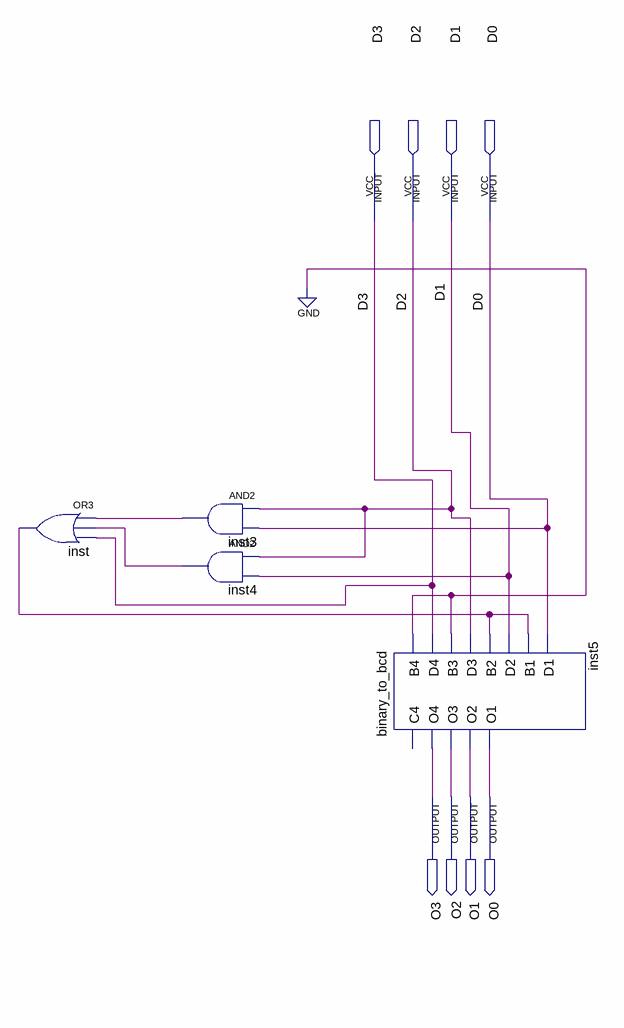
[diagram p0: schematic sheet]
// Quartus schematic Block2.bdf as structural Verilog: 4 symbols, 8 pins
module Block2 (
  input  D3,
  input  D2,
  input  D1,
  input  D0,
  output O3,
  output O2,
  output O1,
  output O0
);

  wire inst3_out, inst4_out, inst_out;

  or inst (inst_out, inst3_out, inst4_out, D3);
  and inst3 (inst3_out, D2, D0);
  and inst4 (inst4_out, D2, D1);
  binary_to_bcd inst5 (
    .B4(1'b0), .D4(D3), .B3(1'b0), .D3(D2), .B2(inst_out), .D2(D1), .B1(inst_out), .D1(D0), .O4(O3), .O3(O2),
    .O2(O1), .O1(O0));  // open: C4
endmodule
